# EAGLE schematic atmega (EAGLE 8.1.1)
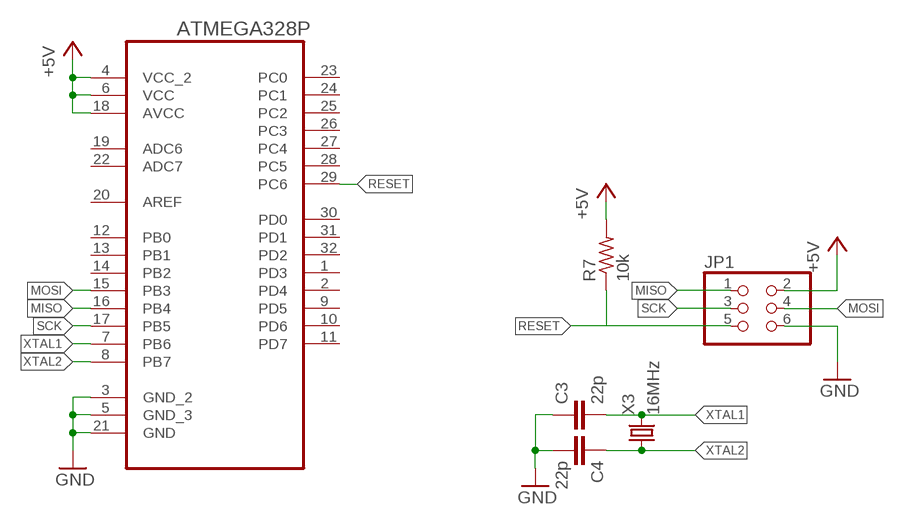
[diagram p0: schematic, sheet 1]

## Parts
ATMEGA328P  ATMEGA328P-AU  [QFP80P900X900X120-32N]
C3  22p  C-EUC0805K  [C0805K]
C4  22p  C-EUC0805K  [C0805K]
JP1  PINHD-2X3  [2X03]
R7  10k  R-US_R0805  [R0805]
X3  16MHz  CRYSTAL  [QS]

## Nets
+5V: ATMEGA328P.4(VCC_2) ATMEGA328P.6(VCC) ATMEGA328P.18(AVCC) JP1.2 R7.2
GND: ATMEGA328P.3(GND_2) ATMEGA328P.5(GND_3) ATMEGA328P.21(GND) C3.1 C4.2 JP1.6
MISO: ATMEGA328P.16(PB4) JP1.1
MOSI: ATMEGA328P.15(PB3) JP1.4
RESET: ATMEGA328P.29(PC6) JP1.5 R7.1
SCK: ATMEGA328P.17(PB5) JP1.3
XTAL1: ATMEGA328P.7(PB6) C3.2 X3.2
XTAL2: ATMEGA328P.8(PB7) C4.1 X3.1
Unconnected: ATMEGA328P.1(PD3) ATMEGA328P.2(PD4) ATMEGA328P.9(PD5) ATMEGA328P.10(PD6) ATMEGA328P.11(PD7) ATMEGA328P.12(PB0) ATMEGA328P.13(PB1) ATMEGA328P.14(PB2) ATMEGA328P.19(ADC6) ATMEGA328P.20(AREF) ATMEGA328P.22(ADC7) ATMEGA328P.23(PC0) ATMEGA328P.24(PC1) ATMEGA328P.25(PC2) ATMEGA328P.26(PC3) ATMEGA328P.27(PC4) ATMEGA328P.28(PC5) ATMEGA328P.30(PD0) ATMEGA328P.31(PD1) ATMEGA328P.32(PD2)

## Library data of the parts
ATMEGA328P = Atmel_By_element14_Batch_1-00:ATMEGA328P-AU: 8-bit Microcontroller with In-System Programmable Flash; MPN: ATMEGA328P-AU; OC_FARNELL: 1715486; OC_NEWARK: 14R4631; PACKAGE: TQFP-32; SUPPLIER: Atmel
C3 C4 = resistor:C-EU: CAPACITOR, European symbol
JP1 = pinhead:PINHD-2X3: PIN HEADER
R7 = rcl:R-US_: RESISTOR, American symbol
X3 = crystal:CRYSTAL